# Altium schematic sheet P16 POWER1.SchDoc
size 420 x 297 mm
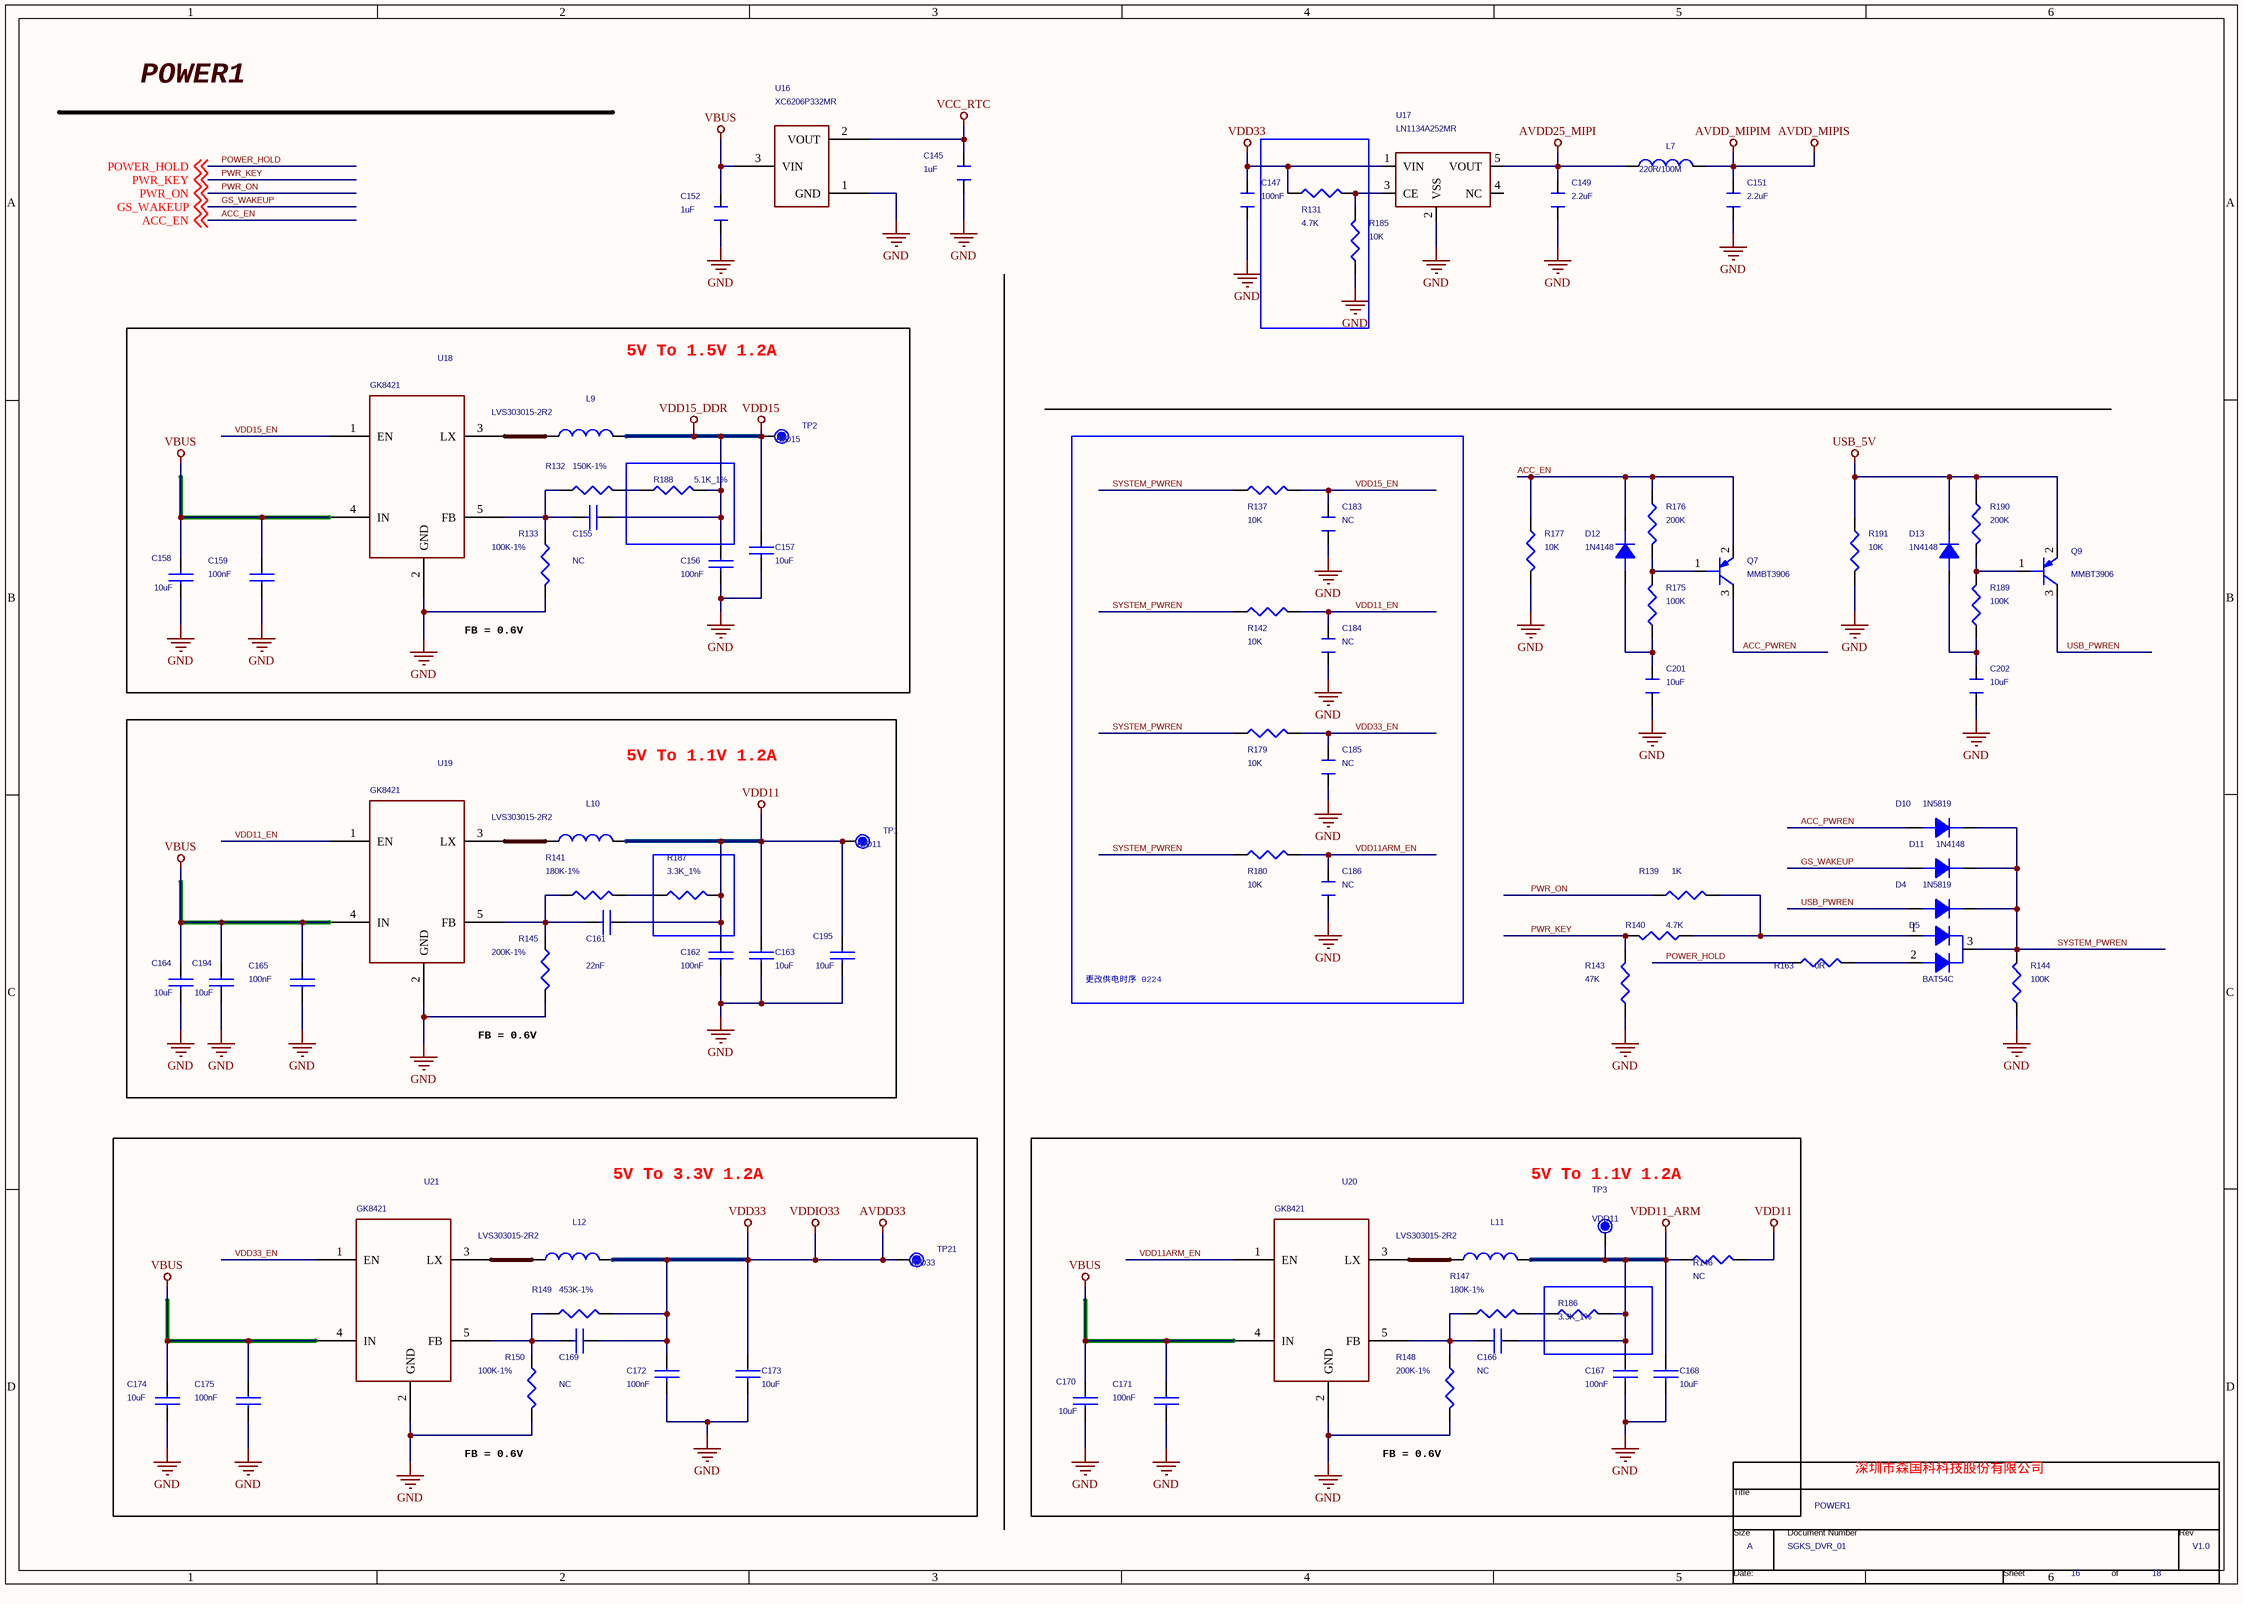
[diagram p0: P16 POWER1.SchDoc]

## Parts
*  Page Count: 18  Page Number: 16  Page Size: A  Title: POWER1  RevCode: V1.0  Doc: SGKS_DVR_01  (hidden comment: TitleBlock0)  (graphical)
C145  1uF  [C0402]
C147  100nF  [C0402]
C149  2.2uF  [C0402]
C151  2.2uF  [C0402]
C152  1uF  [C0402]
C155  NC  [C0402]
C156  100nF  [C0402]
C157  10uF  [C0603]
C158  10uF  [C0603]
C159  100nF  [C0402]
C161  22nF  [C0402]
C162  100nF  [C0402]
C163  10uF  [C0603]
C164  10uF  [C0603]
C165  100nF  [C0402]
C166  NC  [C0402]
C167  100nF  [C0402]
C168  10uF  [C0603]
C169  NC  [C0402]
C170  10uF  [C0603]
C171  100nF  [C0402]
C172  100nF  [C0402]
C173  10uF  [C0603]
C174  10uF  [C0603]
C175  100nF  [C0402]
C183  NC  [C0402]
C184  NC  [C0402]
C185  NC  [C0402]
C186  NC  [C0402]
C194  10uF  [C0603]
C195  10uF  [C0603]
C201  10uF  [C0603]
C202  10uF  [C0603]
D4  1N5819  [SOD-123]
D5  BAT54C  [SOT-23]
D10  1N5819  [SOD-123]
D11  1N4148  [SOD-123]
D12  1N4148  [SOD-123]
D13  1N4148  [SOD-123]
L7  220R/100M  [L0402]
L9  LVS303015-2R2  [PL4X4]
L10  LVS303015-2R2  [PL4X4]
L11  LVS303015-2R2  [PL4X4]
L12  LVS303015-2R2  [PL4X4]
Q7  MMBT3906  [SOT-23]
Q9  MMBT3906  [SOT-23]
R131  4.7K  [R0603/SMD]
R132  150K-1%  [R0402]
R133  100K-1%  [R0402]
R137  10K  [R0402]
R139  1K  [R0402]
R140  4.7K  [R0402]
R141  180K-1%  [R0402]
R142  10K  [R0402]
R143  47K  [R0402]
R144  100K  [R0402]
R145  200K-1%  [R0402]
R146  NC  [R0603]
R147  180K-1%  [R0402]
R148  200K-1%  [R0402]
R149  453K-1%  [R0402]
R150  100K-1%  [R0402]
R163  0R  [R0402]
R175  100K  [R0402]
R176  200K  [R0402]
R177  10K  [R0402]
R179  10K  [R0402]
R180  10K  [R0402]
R185  10K  [R0603/SMD]
R186  3.3K_1%  [R0402]
R187  3.3K_1%  [R0402]
R188  5.1K_1%  [R0402]
R189  100K  [R0402]
R190  200K  [R0402]
R191  10K  [R0402]
TP1  VDD11  [TP/SMD/D1.0]
TP2  VDD15  [TP/SMD/D1.0]
TP3  VDD11  [TP/SMD/D1.0]
TP21  VDD33  [TP/SMD/D1.0]
U16  XC6206P332MR  [SOT-23]
U17  LN1134A252MR  [SOT23-6]
U18  GK8421  [SOT23-5]
U19  GK8421  [SOT23-5]
U20  GK8421  [SOT23-5]
U21  GK8421  [SOT23-5]

## Blocks framed on the sheet
5V To 1.5V 1.2A: C155-C159 L9 R132 R133 R188 TP2 U18
更改供电时序 0224: C183-C186 R137 R142 R179 R180
5V To 1.1V 1.2A: C161-C165 C194 C195 L10 R141 R145 R187 TP1 U19
5V To 3.3V 1.2A: C169 C172-C175 L12 R149 R150 TP21 U21
5V To 1.1V 1.2A: * C166-C168 C170 C171 L11 R146-R148 R186 TP3 U20

## Nets
AVDD25_MIPI: C149.2 L7.2 U17.5(VOUT)
AVDD33: C147.2 C169.1 C172.1 C173.1 L12.2 R131.1 R149.1 TP21.1 U17.1(VIN)  [also labelled VDD33, VDDIO33]
AVDD_MIPIM: C151.2 L7.1  [also labelled AVDD_MIPIS]
GND: C145.1 C147.1 C149.1 C151.1 C152.1 C156.2 C157.2 C158.2 C159.2 C162.2 C163.2 C164.2 C165.2 C167.2 C168.2 C170.2 C171.2 C172.2 C173.2 C174.2 C175.2 C183.1 C184.1 C185.1 C186.1 C194.2 C195.2 C201.1 C202.1 R133.2 R143.2 R144.2 R145.2 R148.2 R150.2 R177.2 R185.1 R191.2 U16.1(GND) U17.2(VSS) U18.2(GND) U19.2(GND) U20.2(GND) U21.2(GND)
USB_5V: D13.2(K) Q9.2(E) R190.1 R191.1
VBUS: C152.2 C158.1 C159.1 C164.1 C165.1 C170.1 C171.1 C174.1 C175.1 C194.1 U16.3(VIN) U18.4(IN) U19.4(IN) U20.4(IN) U21.4(IN)
VCC_RTC: C145.2 U16.2(VOUT)
VDD11: C161.1 C162.1 C163.1 C195.1 L10.2 R146.2 R187.1 TP1.1
VDD11_ARM: C166.1 C167.1 C168.1 L11.2 R146.1 R186.1 TP3.1
VDD15: C155.1 C156.1 C157.1 L9.2 R188.1 TP2.1  [also labelled VDD15_DDR]
ACC_EN: D12.2(K) Q7.2(E) R176.1 R177.1 ; off-sheet ACC_EN
ACC_PWREN: D10.1(A) Q7.3(C)
GS_WAKEUP: D11.1(A) ; off-sheet GS_WAKEUP
POWER_HOLD: R163.2 ; off-sheet POWER_HOLD
PWR_KEY: R140.1 R143.1 ; off-sheet PWR_KEY
PWR_ON: R139.2 ; off-sheet PWR_ON
SYSTEM_PWREN: D4.2(K) D5.3(K) D10.2(K) D11.2(K) R137.1 R142.1 R144.1 R179.1 R180.1
USB_PWREN: D4.1(A) Q9.3(C)
VDD11_EN: C184.2 R142.2 U19.1(EN)
VDD11ARM_EN: C186.2 R180.2 U20.1(EN)
VDD15_EN: C183.2 R137.2 U18.1(EN)
VDD33_EN: C185.2 R179.2 U21.1(EN)
NetC155_2: C155.2 R132.2 R133.1 U18.5(FB)
NetC161_2: C161.2 R141.2 R145.1 U19.5(FB)
NetC166_2: C166.2 R147.2 R148.1 U20.5(FB)
NetC169_2: C169.2 R149.2 R150.1 U21.5(FB)
NetC201_2: C201.2 D12.1(A) R175.1
NetC202_2: C202.2 D13.1(A) R189.1
NetD5_1: D5.1(A1) R139.1 R140.2
NetD5_2: D5.2(A2) R163.1
NetL9_1: L9.1 U18.3(LX)
NetL10_1: L10.1 U19.3(LX)
NetL11_1: L11.1 U20.3(LX)
NetL12_1: L12.1 U21.3(LX)
NetQ7_1: Q7.1(B) R175.2 R176.2
NetQ9_1: Q9.1(B) R189.2 R190.2
NetR131_2: R131.2 R185.2 U17.3(CE)
NetR132_1: R132.1 R188.2
NetR141_1: R141.1 R187.2
NetR147_1: R147.1 R186.2

Not connected (* = marked no-connect by the designer): U17 4(NC)

## Notes on the sheet
- POWER1
- FB = 0.6V
- 深圳市森国科科技股份有限公司
- (in symbol TitleBlock0) Title; Size; Document Number; Rev; Date:; Sheet; of

## Library data of the parts
C145 C147 C149 C151 C152 C201 C202 = CAPACITOR: PAGE: 1
C155-C159 C161-C175 C194 C195 = CAP
C183-C186 = CAPACITOR: Page: 10
D4 D10-D13 = DIODE
D5 = DIODE_1: 二极管
L7 = INDUCTOR_2
L9-L12 = INDUCTOR_Dup1
Q7 Q9 = PNP CEB
R131 R185 = RES/SMD_1: Part Description: Chip Resistor; Type: 贴片电阻
R132 R133 R141 R145-R150 R186-R188 = RESISTOR_Dup2
R137 R140 R142-R144 R177 R179 R180 R191 = R_Dup1
R139 R163 R175 R176 R189 R190 = R
TP1-TP3 TP21 = TP_0: Part Description: Test Point; Type: NC
U16 = RT9166
U17 = RT9266PE_0
U18-U21 = MP2161_2
* = TitleBlock0: Page Create Date: March  8, 1995